# EAGLE schematic 1206_1210 (EAGLE 9.4.2)
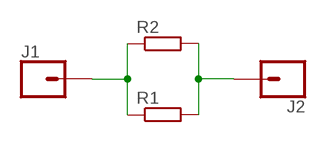
[diagram p0: schematic, sheet 1]

## Parts
J1  CONN_01  [1X01]
J2  CONN_01  [1X01]
R1  R-EU_R1210  [R1210]
R2  R-EU_R1206  [R1206]

## Nets
N$1: J1.1 R1.1 R2.1
N$2: J2.1 R1.2 R2.2

## Library data of the parts
J1 J2 = bschulz:CONN_01: Single connection point. Often used as Generic Header-pin footprint for 0.1 inch spaced/style header connections On any of the 0.1 inch spaced packages, you can populate with these: Break Away Headers - Straight <https://www.sparkfun.com/products/116> (PRT-00116) Break Away Male Headers - Right Angle <https://www.sparkfun.com/products/553> (PRT-00553) Female Headers <https://www.sparkfun.com/products/115> (PRT-00115) Break Away Headers - Machine Pin <https://www.sparkfun.com/products/117> (PRT-00117) Break Away Female Headers - Swiss Machine Pin <https://www.sparkfun.com/products/743> (PRT-00743) This device is also useful as a general connection point to wire up your design to another part of your project. Our various solder wires solder well into these plated through hole pads. Hook-Up Wire - Assortment (Stranded, 22 AWG) <https://www.sparkfun.com/products/11375> (PRT-11375) Hook-Up Wire - Assortment (Solid Core, 22 AWG) <https://www.sparkfun.com/products/11367> (PRT-11367) View the entire wire category on our website here <https://www.sparkfun.com/categories/141> Special notes: SMTSO-256-ET is a "flush mount" nut for a 4-40 screw. We mostly use this on specialty testbeds; it is a nice way to connect hardware to your PCB at an adjustable hieght. Also note, the SNAP packages are for using a snappable style connector. We sell a baggie of snaps and they are also used on two LilyPad designs: Snap Assortment - 30 pack (male and female) <https://www.sparkfun.com/products/11347> (DEV-11347) LilyPad Arduino SimpleSnap <https://www.sparkfun.com/products/10941> (DEV-10941) LilyPad SimpleSnap Protoboard <https://www.sparkfun.com/products/10940> (DEV-10940)
R1 R2 = bschulz_passives:R-EU_: RESISTOR, European symbol Digikey Parts: Yageo, 0402 <https://www.digikey.com/products/en/resistors/chip-resistor-surface-mount/52?k=&pkeyword=&sv=0&s=4356&sf=1&FV=-1%7C13%2C7%7C2%2C1291%7C39157%2C1989%7C0%2C-8%7C52%2C3%7C1131%2C3%7C2503&quantity=&ColumnSort=0&page=1&stock=1&pageSize=25> Yageo, 0603 <https://www.digikey.com/products/en/resistors/chip-resistor-surface-mount/52?k=&pkeyword=&sv=0&pv1291=39245&sf=1&FV=-5%7C4356%2C-5%7C47360%2C-8%7C52%2C-1%7C13%2C7%7C2%2C1989%7C0&quantity=10&ColumnSort=1000011&page=1&stock=1&pageSize=25> Panasonic, 0603 <https://www.digikey.com/products/en/resistors/chip-resistor-surface-mount/52?k=&pkeyword=&pv252=68&sf=0&FV=ffec373d%2C1c0002%2C142c040c%2C1f140000%2Cffe00034%2C80002%2Cc0001&quantity=&ColumnSort=0&page=1&stock=1&pageSize=25> Panasonic, precision, 0603 <https://www.digikey.com/products/en/resistors/chip-resistor-surface-mount/52?FV=ffec4907%2Cfffc000a%2Cc0172%2C142c040c%2C1f140000%2Cffe00034%2C1c0002&quantity=100&ColumnSort=2085&page=1&stock=1&pageSize=25> Panasonic, 0805 <https://www.digikey.com/products/en/resistors/chip-resistor-surface-mount/52?k=&pkeyword=&pv3=1&sf=0&FV=ffec373d%2C1c0002%2C1f140000%2Cffe00034%2C142c040d&quantity=&ColumnSort=0&page=1&stock=1&pageSize=25> Rohm, current sense <https://www.digikey.com/products/en/resistors/chip-resistor-surface-mount/52?k=&pkeyword=&pv3=1&sf=0&FV=ffecb688%2C1f140000%2Cffe00034%2C1c0002&quantity=&ColumnSort=0&page=1&stock=1&pageSize=25> Vishay, pulse proof automotive <https://www.digikey.com/products/en/resistors/chip-resistor-surface-mount/52?k=&pkeyword=&pv7=2&sf=0&FV=ffec5d6b%2Cffe00034%2C1f140000&quantity=&ColumnSort=0&page=1&stock=1&pageSize=25>